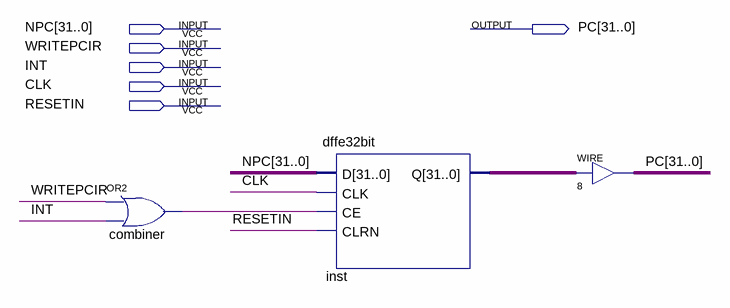
[diagram p0: schematic sheet]
// Quartus schematic PC-BUFFER.bdf as structural Verilog: 3 symbols, 6 pins
module \PC-BUFFER  (
  input  [31:0] NPC,
  input  WRITEPCIR,
  input  INT,
  input  CLK,
  input  RESETIN,
  output [31:0] PC
);

  wire combiner_out;
  wire [31:0] inst_q;

  or combiner (combiner_out, WRITEPCIR, INT);
  dffe32bit inst (.D(NPC), .CLK(CLK), .CE(combiner_out), .CLRN(RESETIN), .Q(inst_q));
  assign PC = inst_q;  // WIRE 8
endmodule
